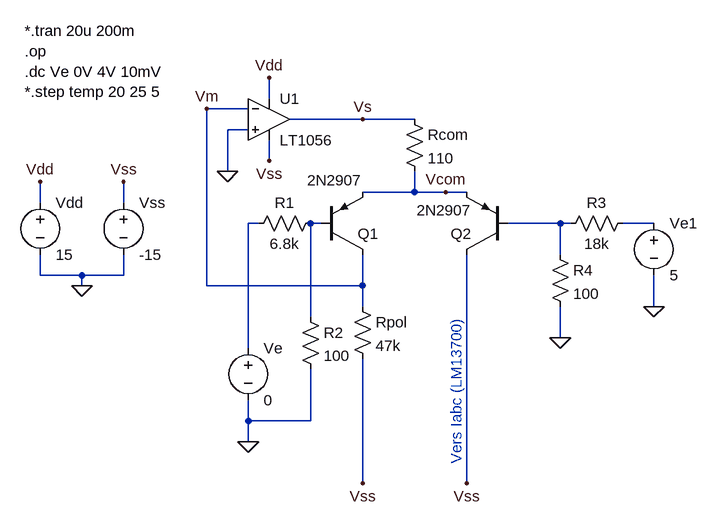
[diagram p0: schematic exp-converter-vco-pnp.asc]
exp-converter-vco-pnp.asc, the LTspice schematic file:
Version 4
SHEET 1 1672 680
WIRE 1008 -16 1008 -48
WIRE 976 0 912 0
WIRE 1152 16 1040 16
WIRE 1232 16 1152 16
WIRE 976 32 944 32
WIRE 1008 80 1008 48
WIRE 944 96 944 32
WIRE 1232 128 1232 96
WIRE 1232 128 1152 128
WIRE 1280 128 1232 128
WIRE 1312 128 1280 128
WIRE 656 144 656 112
WIRE 784 144 784 112
WIRE 992 176 976 176
WIRE 1088 176 1072 176
WIRE 1456 176 1376 176
WIRE 1472 176 1456 176
WIRE 1600 176 1552 176
WIRE 1456 224 1456 176
WIRE 656 256 656 224
WIRE 720 256 656 256
WIRE 784 256 784 224
WIRE 784 256 720 256
WIRE 720 272 720 256
WIRE 912 272 912 0
WIRE 1152 272 1152 224
WIRE 1152 272 912 272
WIRE 1152 304 1152 272
WIRE 1600 304 1600 256
WIRE 1072 320 1072 176
WIRE 1456 352 1456 304
WIRE 976 368 976 176
WIRE 976 480 976 448
WIRE 1072 480 1072 400
WIRE 1072 480 976 480
WIRE 976 512 976 480
WIRE 1152 576 1152 384
WIRE 1312 576 1312 224
FLAG 720 272 0
FLAG 656 112 Vdd
FLAG 1008 -48 Vdd
FLAG 784 112 Vss
FLAG 1008 80 Vss
FLAG 944 96 0
FLAG 976 512 0
FLAG 1152 576 Vss
FLAG 1312 576 Vss
FLAG 912 0 Vm
FLAG 1152 16 Vs
FLAG 1280 128 Vcom
FLAG 1600 304 0
FLAG 1456 352 0
SYMBOL Opamps/LT1056 1008 -48 R0
SYMATTR InstName U1
SYMBOL voltage 656 128 R0
SYMATTR InstName Vdd
SYMATTR Value 15
SYMBOL voltage 784 128 R0
SYMATTR InstName Vss
SYMATTR Value -15
SYMBOL voltage 976 352 R0
WINDOW 123 24 118 Left 2
SYMATTR InstName Ve
SYMATTR Value 0
SYMBOL pnp 1088 224 M180
WINDOW 3 -21 114 Left 2
SYMATTR InstName Q1
SYMATTR Value 2N2907
SYMBOL pnp 1376 224 R180
SYMATTR InstName Q2
SYMATTR Value 2N2907
SYMBOL res 1216 0 R0
SYMATTR InstName Rcom
SYMATTR Value 110
SYMBOL res 1136 288 R0
SYMATTR InstName Rpol
SYMATTR Value 47k
SYMBOL voltage 1600 160 R0
WINDOW 123 24 118 Left 2
SYMATTR InstName Ve1
SYMATTR Value 5
SYMBOL res 1440 208 R0
SYMATTR InstName R4
SYMATTR Value 100
SYMBOL res 1568 160 R90
WINDOW 0 0 56 VBottom 2
WINDOW 3 32 56 VTop 2
SYMATTR InstName R3
SYMATTR Value 18k
SYMBOL res 1088 160 R90
WINDOW 0 0 56 VBottom 2
WINDOW 3 32 56 VTop 2
SYMATTR InstName R1
SYMATTR Value 6.8k
SYMBOL res 1056 304 R0
SYMATTR InstName R2
SYMATTR Value 100
TEXT 632 -120 Left 2 !*.tran 20u 200m\n.op\n.dc Ve 0V 4V 10mV\n*.step temp 20 25 5
TEXT 1296 320 VRight 2 ;Vers Iabc (LM13700)

The netlist it stands for:
* exp-converter-vco-pnp.asc
XU1 0 Vm Vdd Vss Vs LT1056  ; pins In+ In- V+ V- OUT
Vdd Vdd 0 15
Vss Vss 0 -15
Ve N001 0 0
Q1 Vm N002 Vcom 0 2N2907
Q2 Vss N003 Vcom 0 2N2907
Rcom Vs Vcom 110
Rpol Vm Vss 47k
Ve1 N004 0 5
R4 N003 0 100
R3 N004 N003 18k
R1 N002 N001 6.8k
R2 N002 0 100
.model NPN NPN
.model PNP PNP
.lib standard.bjt
*.tran 20u 200m
.op
.dc Ve 0V 4V 10mV
*.step temp 20 25 5
* Vers Iabc (LM13700)
.backanno
.end